# Altium schematic sheet 03_LORA.SchDoc
size A4
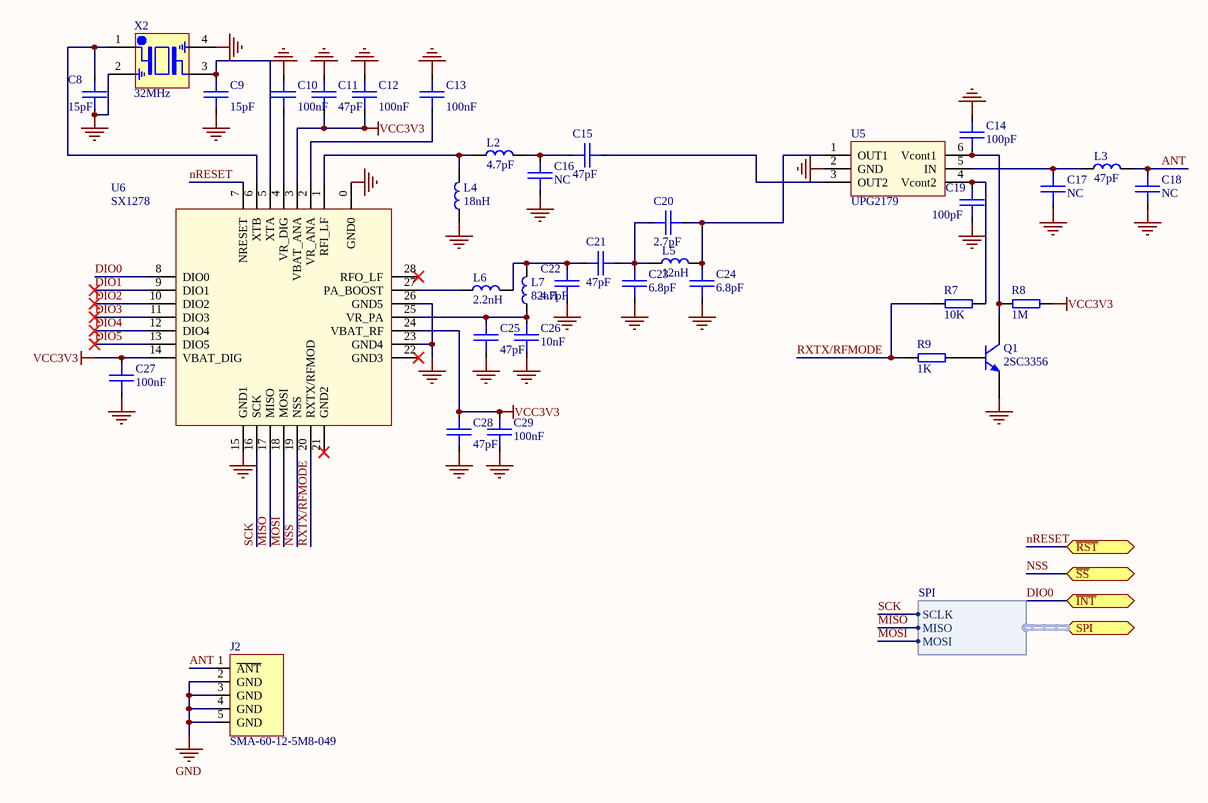
[diagram p0: 03_LORA.SchDoc]

## Parts
C8  15pF  [SMT_C_0402]
C9  15pF  [SMT_C_0402]
C10  100nF  [SMT_C_0402]
C11  47pF  [SMT_C_0402]
C12  100nF  [SMT_C_0402]
C13  100nF  [SMT_C_0402]
C14  100pF  [SMT_C_0402]
C15  47pF  [SMT_C_0402]
C16  NC  [SMT_C_0402]
C17  NC  [SMT_C_0402]
C18  NC  [SMT_C_0402]
C19  100pF  [SMT_C_0402]
C20  2.7pF  [SMT_C_0402]
C21  47pF  [SMT_C_0402]
C22  4.7pF  [SMT_C_0402]
C23  6.8pF  [SMT_C_0402]
C24  6.8pF  [SMT_C_0402]
C25  47pF  [SMT_C_0402]
C26  10nF  [SMT_C_0402]
C27  100nF  [SMT_C_0402]
C28  47pF  [SMT_C_0402]
C29  100nF  [SMT_C_0402]
J2  SMA-60-12-5M8-049  [SMA-60-12-5M8-049]
L2  4.7pF  [SMT_L_0402]
L3  47pF  [SMT_L_0402]
L4  18nH  [SMT_L_0402]
L5  12nH  [SMT_L_0402]
L6  2.2nH  [SMT_L_0402]
L7  82nH  [SMT_L_0402]
Q1  2SC3356  [SOT-23S]
R7  10K  [SMT_R_0402]
R8  1M  [SMT_R_0402]
R9  1K  [SMT_R_0402]
U5  UPG2179  [SC70-6]
U6  SX1278  [QFN28-6x6]
X2  32MHz  [SMT_XTAL_3225]

## Ports
SPI (harness SPI), ~{INT}, ~{RST}, ~{SS}

## Harnesses
SPI: MISO, MOSI, SCLK

## Nets
GND: C8.1 C9.1 C10.2 C11.1 C12.2 C13.2 C14.2 C16.1 C17.1 C18.1 C19.1 C22.1 C23.1 C24.1 C25.1 C26.1 C27.2 C28.1 C29.1 J2.2(GND) J2.3(GND) J2.4(GND) J2.5(GND) L4.2 Q1.2(E) U5.2(GND) U6.0(GND0) U6.15(GND1) U6.23(GND4) U6.26(GND5) X2.2(GND) X2.4(GND)
VCC3V3: C11.2 C12.1 C27.1 C28.2 C29.2 R8.2 U6.3(VBAT_ANA) U6.14(VBAT_DIG) U6.24(VBAT_RF)
ANT: C18.2 J2.1(~{ANT}) L3.1
DIO0: U6.8(DIO0) ; port ~{INT}
DIO1: U6.9(DIO1)
DIO2: U6.10(DIO2)
DIO3: U6.11(DIO3)
DIO4: U6.12(DIO4)
DIO5: U6.13(DIO5)
MISO: U6.17(MISO) ; port SPI.MISO
MOSI: U6.18(MOSI) ; port SPI.MOSI
nRESET: U6.7(NRESET) ; port ~{RST}
NSS: U6.19(NSS) ; port ~{SS}
RXTX/RFMODE: R7.1 R9.1 U6.20(RXTX/RFMOD)
SCK: U6.16(SCK) ; port SPI.SCLK
NetC8_2: C8.2 U6.6(XTB) X2.1(IN/OUT)
NetC9_2: C9.2 U6.5(XTA) X2.3(IN/OUT)
NetC10_1: C10.1 U6.4(VR_DIG)
NetC13_1: C13.1 U6.2(VR_ANA)
NetC14_1: C14.1 Q1.3(C) R8.1 U5.6(Vcont1)
NetC15_1: C15.1 U5.3(OUT2)
NetC15_2: C15.2 C16.2 L2.1
NetC17_2: C17.2 L3.2 U5.5(IN)
NetC19_2: C19.2 R7.2 U5.4(Vcont2)
NetC20_1: C20.1 C21.2 C23.2 L5.2
NetC20_2: C20.2 C24.2 L5.1 U5.1(OUT1)
NetC21_1: C21.1 C22.2 L6.1 L7.1
NetC25_2: C25.2 C26.2 L7.2 U6.25(VR_PA)
NetL2_2: L2.2 L4.1 U6.1(RFI_LF)
NetL6_2: L6.2 U6.27(PA_BOOST)
NetQ1_1: Q1.1(B) R9.2

Not connected (* = marked no-connect by the designer): U6 21(GND2)* 22(GND3)* 28(RFO_LF)*

## Library data of the parts
C8-C29 = SMT_C_0402_1: Surface mount capacitor 0402
J2 = SMA-60-12-5M8-049: sma 60-12-5M8-049
L2-L7 = SMT_L_0402: Surface mount inductor 0402
Q1 = NPN: NPN Bipolar Transistor; Published: 8-Jun-2000; LatestRevisionDate: 17-Jul-2002; LatestRevisionNote: Re-released for DXP Platform.; PackageReference: TO-226-AA; Publisher: Altium Limited; PackageDescription: TO, Flat Index; 3 In-Line, Axial Leads; Body Dia. 4.8mm; Leads 0.55 x 0.51 mm (max); Code_JEDEC: TO-226-AA
R7-R9 = SMT_R_0402: Surface mount resistor 0402
X2 = SMT_XTAL_PASSIVE: Passive crystal